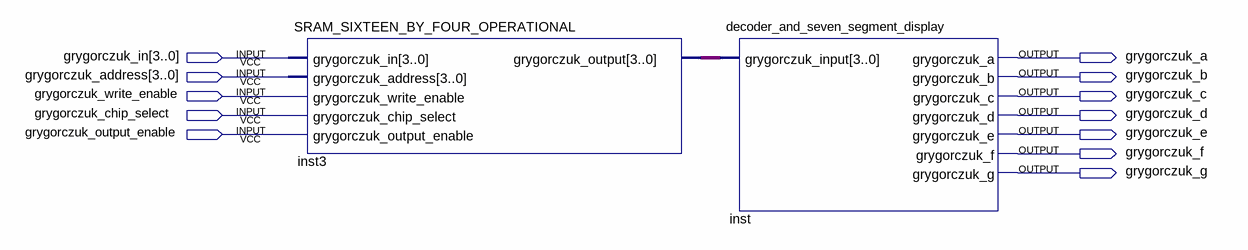
[diagram p0: schematic sheet]
// Quartus schematic SRAM_NORMAL.bdf as structural Verilog: 2 symbols, 12 pins
module SRAM_NORMAL (
  input  [3:0] grygorczuk_in,
  input  [3:0] grygorczuk_address,
  input  grygorczuk_write_enable,
  input  grygorczuk_chip_select,
  input  grygorczuk_output_enable,
  output grygorczuk_a,
  output grygorczuk_b,
  output grygorczuk_c,
  output grygorczuk_d,
  output grygorczuk_e,
  output grygorczuk_f,
  output grygorczuk_g
);

  wire [3:0] inst3_grygorczuk_output;

  SRAM_SIXTEEN_BY_FOUR_OPERATIONAL inst3 (
    .grygorczuk_in(grygorczuk_in), .grygorczuk_address(grygorczuk_address),
    .grygorczuk_write_enable(grygorczuk_write_enable), .grygorczuk_chip_select(grygorczuk_chip_select),
    .grygorczuk_output_enable(grygorczuk_output_enable), .grygorczuk_output(inst3_grygorczuk_output));
  decoder_and_seven_segment_display inst (
    .grygorczuk_input(inst3_grygorczuk_output), .grygorczuk_a(grygorczuk_a), .grygorczuk_b(grygorczuk_b),
    .grygorczuk_c(grygorczuk_c), .grygorczuk_d(grygorczuk_d), .grygorczuk_e(grygorczuk_e),
    .grygorczuk_f(grygorczuk_f), .grygorczuk_g(grygorczuk_g));
endmodule
